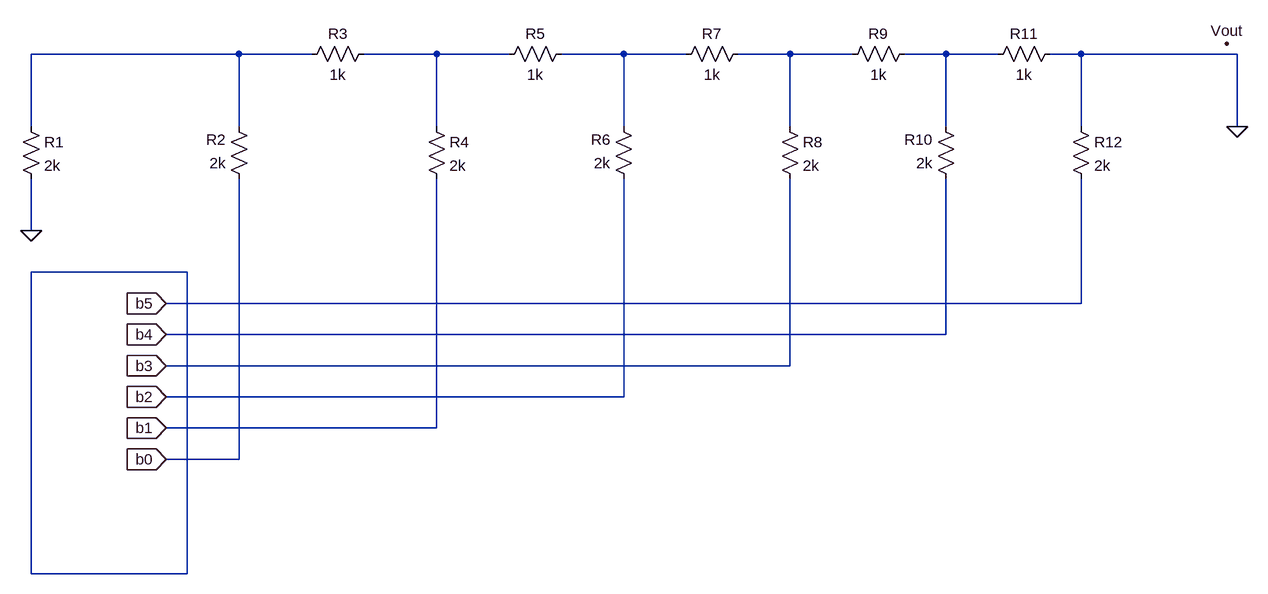
[diagram p0: schematic Draft1.asc]
Draft1.asc, the LTspice schematic file:
Version 4
SHEET 1 1532 680
WIRE -32 -448 -352 -448
WIRE 80 -448 -32 -448
WIRE 272 -448 160 -448
WIRE 384 -448 272 -448
WIRE 560 -448 464 -448
WIRE 656 -448 560 -448
WIRE 816 -448 736 -448
WIRE 912 -448 816 -448
WIRE 1056 -448 992 -448
WIRE 1136 -448 1056 -448
WIRE 1264 -448 1216 -448
WIRE 1504 -448 1264 -448
WIRE -352 -336 -352 -448
WIRE -32 -336 -32 -448
WIRE 272 -336 272 -448
WIRE 560 -336 560 -448
WIRE 816 -336 816 -448
WIRE 1056 -336 1056 -448
WIRE 1264 -336 1264 -448
WIRE 1504 -336 1504 -448
WIRE -352 -176 -352 -256
WIRE -112 -112 -352 -112
WIRE 1264 -64 1264 -256
WIRE 1264 -64 -144 -64
WIRE 1056 -16 1056 -256
WIRE 1056 -16 -144 -16
WIRE 816 32 816 -256
WIRE 816 32 -144 32
WIRE 560 80 560 -256
WIRE 560 80 -144 80
WIRE 272 128 272 -256
WIRE 272 128 -144 128
WIRE -32 176 -32 -256
WIRE -32 176 -144 176
WIRE -352 352 -352 -112
WIRE -112 352 -112 -112
WIRE -112 352 -352 352
FLAG 1504 -336 0
FLAG -352 -176 0
FLAG -144 -64 b5
IOPIN -144 -64 In
FLAG -144 -16 b4
IOPIN -144 -16 In
FLAG -144 32 b3
IOPIN -144 32 In
FLAG -144 80 b2
IOPIN -144 80 In
FLAG -144 128 b1
IOPIN -144 128 In
FLAG -144 176 b0
IOPIN -144 176 In
FLAG 1488 -464 Vout
SYMBOL res -368 -352 R0
SYMATTR InstName R1
SYMATTR Value 2k
SYMBOL res -16 -240 R180
WINDOW 0 36 76 Left 2
WINDOW 3 36 40 Left 2
SYMATTR InstName R2
SYMATTR Value 2k
SYMBOL res 64 -432 R270
WINDOW 0 32 56 VTop 2
WINDOW 3 0 56 VBottom 2
SYMATTR InstName R3
SYMATTR Value 1k
SYMBOL res 256 -352 R0
SYMATTR InstName R4
SYMATTR Value 2k
SYMBOL res 480 -464 R90
WINDOW 0 0 56 VBottom 2
WINDOW 3 32 56 VTop 2
SYMATTR InstName R5
SYMATTR Value 1k
SYMBOL res 576 -240 R180
WINDOW 0 36 76 Left 2
WINDOW 3 36 40 Left 2
SYMATTR InstName R6
SYMATTR Value 2k
SYMBOL res 640 -432 R270
WINDOW 0 32 56 VTop 2
WINDOW 3 0 56 VBottom 2
SYMATTR InstName R7
SYMATTR Value 1k
SYMBOL res 800 -352 R0
SYMATTR InstName R8
SYMATTR Value 2k
SYMBOL res 1008 -464 R90
WINDOW 0 0 56 VBottom 2
WINDOW 3 32 56 VTop 2
SYMATTR InstName R9
SYMATTR Value 1k
SYMBOL res 1072 -240 R180
WINDOW 0 36 76 Left 2
WINDOW 3 36 40 Left 2
SYMATTR InstName R10
SYMATTR Value 2k
SYMBOL res 1120 -432 R270
WINDOW 0 32 56 VTop 2
WINDOW 3 0 56 VBottom 2
SYMATTR InstName R11
SYMATTR Value 1k
SYMBOL res 1248 -352 R0
SYMATTR InstName R12
SYMATTR Value 2k

The netlist it stands for:
* Draft1.asc
R1 N001 0 2k
R2 b0 N001 2k
R3 N001 N002 1k
R4 N002 b1 2k
R5 N003 N002 1k
R6 b2 N003 2k
R7 N003 N004 1k
R8 N004 b3 2k
R9 N005 N004 1k
R10 b4 N005 2k
R11 N005 0 1k
R12 0 b5 2k
.backanno
.end